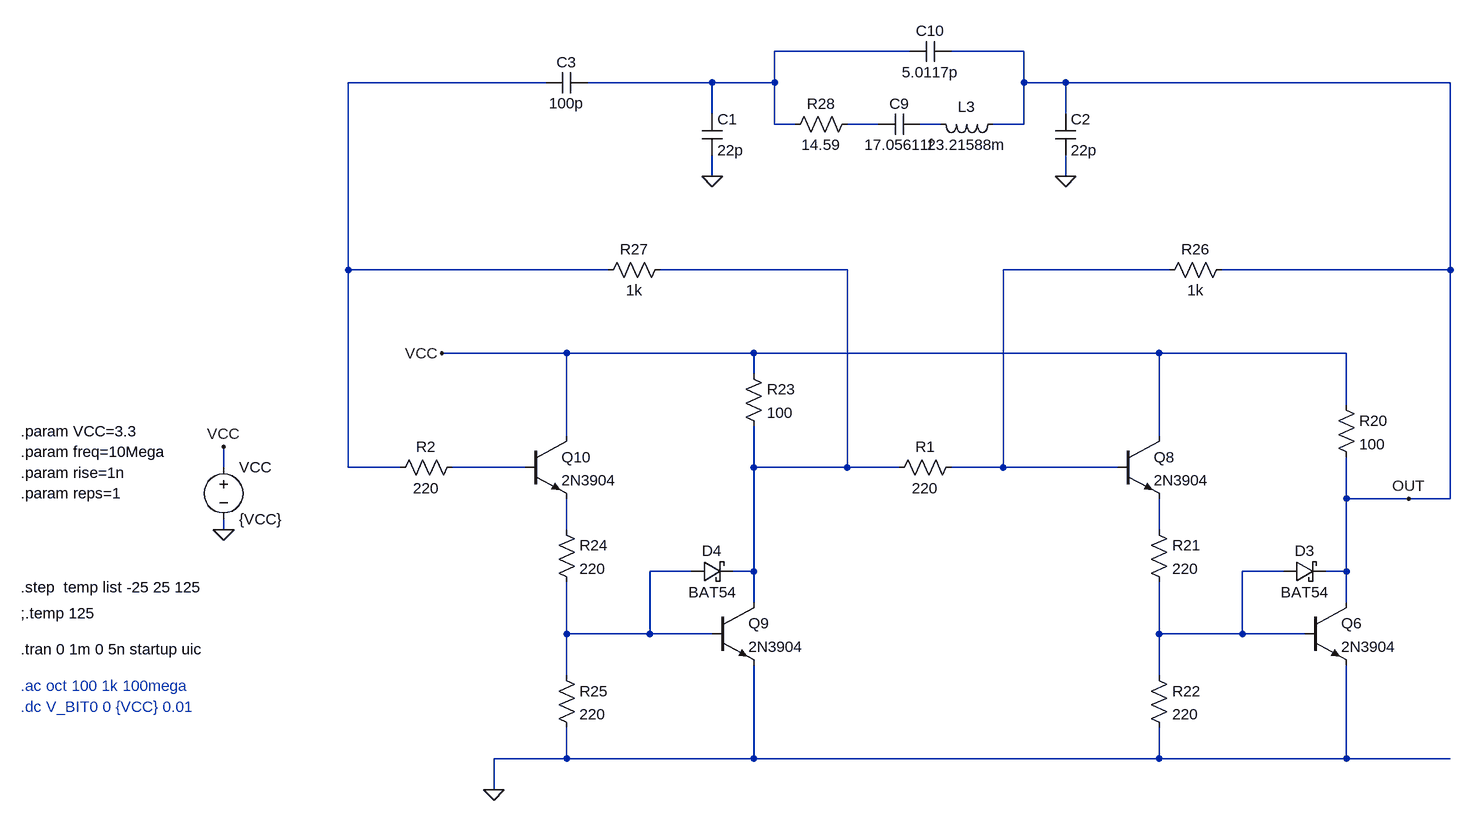
[diagram p0: schematic oscillator.asc]
oscillator.asc, the LTspice schematic file:
Version 4.1
SHEET 1 14868 11268
WIRE -3024 8272 -3232 8272
WIRE -2848 8272 -2960 8272
WIRE -3584 8320 -3888 8320
WIRE -3328 8320 -3520 8320
WIRE -3232 8320 -3232 8272
WIRE -3232 8320 -3328 8320
WIRE -2848 8320 -2848 8272
WIRE -2784 8320 -2848 8320
WIRE -2192 8320 -2784 8320
WIRE -3328 8368 -3328 8320
WIRE -2784 8368 -2784 8320
WIRE -3232 8384 -3232 8320
WIRE -3200 8384 -3232 8384
WIRE -3072 8384 -3120 8384
WIRE -2976 8384 -3008 8384
WIRE -2848 8384 -2848 8320
WIRE -2848 8384 -2896 8384
WIRE -3328 8464 -3328 8432
WIRE -2784 8464 -2784 8432
WIRE -3888 8608 -3888 8320
WIRE -3488 8608 -3888 8608
WIRE -3120 8608 -3408 8608
WIRE -2624 8608 -2880 8608
WIRE -2192 8608 -2192 8320
WIRE -2192 8608 -2544 8608
WIRE -3552 8736 -3744 8736
WIRE -3264 8736 -3552 8736
WIRE -2640 8736 -3264 8736
WIRE -2352 8736 -2640 8736
WIRE -3264 8768 -3264 8736
WIRE -2352 8816 -2352 8736
WIRE -3552 8864 -3552 8736
WIRE -2640 8864 -2640 8736
WIRE -4080 8912 -4080 8880
WIRE -3888 8912 -3888 8608
WIRE -3808 8912 -3888 8912
WIRE -3616 8912 -3728 8912
WIRE -3264 8912 -3264 8848
WIRE -3120 8912 -3120 8608
WIRE -3120 8912 -3264 8912
WIRE -3040 8912 -3120 8912
WIRE -2880 8912 -2880 8608
WIRE -2880 8912 -2960 8912
WIRE -2704 8912 -2880 8912
WIRE -2352 8960 -2352 8896
WIRE -2256 8960 -2352 8960
WIRE -2192 8960 -2192 8608
WIRE -2192 8960 -2256 8960
WIRE -4080 9008 -4080 8992
WIRE -3552 9008 -3552 8960
WIRE -2640 9008 -2640 8960
WIRE -3360 9072 -3424 9072
WIRE -3264 9072 -3264 8912
WIRE -3264 9072 -3296 9072
WIRE -2448 9072 -2512 9072
WIRE -2352 9072 -2352 8960
WIRE -2352 9072 -2384 9072
WIRE -3264 9120 -3264 9072
WIRE -2352 9120 -2352 9072
WIRE -3552 9168 -3552 9088
WIRE -3424 9168 -3424 9072
WIRE -3424 9168 -3552 9168
WIRE -3328 9168 -3424 9168
WIRE -2640 9168 -2640 9088
WIRE -2512 9168 -2512 9072
WIRE -2512 9168 -2640 9168
WIRE -2416 9168 -2512 9168
WIRE -3552 9232 -3552 9168
WIRE -2640 9232 -2640 9168
WIRE -3552 9360 -3552 9312
WIRE -3552 9360 -3664 9360
WIRE -3264 9360 -3264 9216
WIRE -3264 9360 -3552 9360
WIRE -2640 9360 -2640 9312
WIRE -2640 9360 -3264 9360
WIRE -2352 9360 -2352 9216
WIRE -2352 9360 -2640 9360
WIRE -2192 9360 -2352 9360
WIRE -3664 9408 -3664 9360
FLAG -4080 9008 0
FLAG -4080 8880 VCC
FLAG -2256 8960 OUT
FLAG -3744 8736 VCC
FLAG -3664 9408 0
FLAG -3328 8464 0
FLAG -2784 8464 0
SYMBOL voltage -4080 8896 R0
WINDOW 123 0 0 Left 0
WINDOW 39 0 0 Left 0
SYMATTR InstName VCC
SYMATTR Value {VCC}
SYMBOL npn -2416 9120 R0
SYMATTR InstName Q6
SYMATTR Value 2N3904
SYMBOL schottky -2448 9088 R270
WINDOW 0 32 32 VTop 2
WINDOW 3 0 32 VBottom 2
SYMATTR InstName D3
SYMATTR Value BAT54
SYMATTR Description Diode
SYMATTR Type diode
SYMBOL npn -2704 8864 R0
SYMATTR InstName Q8
SYMATTR Value 2N3904
SYMBOL res -2368 8800 R0
SYMATTR InstName R20
SYMATTR Value 100
SYMBOL res -2656 8992 R0
SYMATTR InstName R21
SYMATTR Value 220
SYMBOL res -2656 9216 R0
SYMATTR InstName R22
SYMATTR Value 220
SYMBOL npn -3328 9120 R0
SYMATTR InstName Q9
SYMATTR Value 2N3904
SYMBOL schottky -3360 9088 R270
WINDOW 0 32 32 VTop 2
WINDOW 3 0 32 VBottom 2
SYMATTR InstName D4
SYMATTR Value BAT54
SYMATTR Description Diode
SYMATTR Type diode
SYMBOL npn -3616 8864 R0
SYMATTR InstName Q10
SYMATTR Value 2N3904
SYMBOL res -3280 8752 R0
SYMATTR InstName R23
SYMATTR Value 100
SYMBOL res -3568 8992 R0
SYMATTR InstName R24
SYMATTR Value 220
SYMBOL res -3568 9216 R0
SYMATTR InstName R25
SYMATTR Value 220
SYMBOL res -2528 8592 R90
WINDOW 0 0 56 VBottom 2
WINDOW 3 32 56 VTop 2
SYMATTR InstName R26
SYMATTR Value 1k
SYMBOL res -3392 8592 R90
WINDOW 0 0 56 VBottom 2
WINDOW 3 32 56 VTop 2
SYMATTR InstName R27
SYMATTR Value 1k
SYMBOL ind -2880 8368 R90
WINDOW 0 5 56 VBottom 2
WINDOW 3 32 56 VTop 2
SYMATTR InstName L3
SYMATTR Value 23.21588m
SYMBOL cap -3072 8400 R270
WINDOW 0 32 32 VTop 2
WINDOW 3 0 32 VBottom 2
SYMATTR InstName C9
SYMATTR Value 17.05611f
SYMBOL cap -3024 8288 R270
WINDOW 0 32 32 VTop 2
WINDOW 3 0 32 VBottom 2
SYMATTR InstName C10
SYMATTR Value 5.0117p
SYMBOL res -3216 8400 R270
WINDOW 0 32 56 VTop 2
WINDOW 3 0 56 VBottom 2
SYMATTR InstName R28
SYMATTR Value 14.59
SYMBOL res -2944 8896 R90
WINDOW 0 0 56 VBottom 2
WINDOW 3 32 56 VTop 2
SYMATTR InstName R1
SYMATTR Value 220
SYMBOL res -3712 8896 R90
WINDOW 0 0 56 VBottom 2
WINDOW 3 32 56 VTop 2
SYMATTR InstName R2
SYMATTR Value 220
SYMBOL cap -3344 8368 R0
SYMATTR InstName C1
SYMATTR Value 22p
SYMBOL cap -2800 8368 R0
SYMATTR InstName C2
SYMATTR Value 22p
SYMBOL cap -3520 8304 R90
WINDOW 0 0 32 VBottom 2
WINDOW 3 32 32 VTop 2
SYMATTR InstName C3
SYMATTR Value 100p
TEXT -4392 9192 Left 2 !.tran 0 1m 0 5n startup uic
TEXT -4392 9248 Left 2 ;.ac oct 100 1k 100mega
TEXT -4392 9280 Left 2 ;.dc V_BIT0 0 {VCC} 0.01
TEXT -4392 8856 Left 2 !.param VCC=3.3
TEXT -4392 8888 Left 2 !.param freq=10Mega
TEXT -4392 8920 Left 2 !.param rise=1n
TEXT -4392 8952 Left 2 !.param reps=1
TEXT -4392 9096 Left 2 !.step  temp list -25 25 125
TEXT -4392 9136 Left 2 !;.temp 125

The netlist it stands for:
* oscillator.asc
VCC VCC 0 {VCC}
Q6 OUT N011 0 0 2N3904
D3 N011 OUT BAT54
Q8 VCC N006 N009 0 2N3904
R20 VCC OUT 100
R21 N009 N011 220
R22 N011 0 220
Q9 N005 N010 0 0 2N3904
D4 N010 N005 BAT54
Q10 VCC N007 N008 0 2N3904
R23 VCC N005 100
R24 N008 N010 220
R25 N010 0 220
R26 OUT N006 1k
R27 N005 N002 1k
L3 OUT N004 23.21588m
C9 N003 N004 17.05611f
C10 N001 OUT 5.0117p
R28 N001 N003 14.59
R1 N006 N005 220
R2 N007 N002 220
C1 N001 0 22p
C2 OUT 0 22p
C3 N001 N002 100p
.model D D
.lib standard.dio
.model NPN NPN
.model PNP PNP
.lib standard.bjt
.tran 0 1m 0 5n startup uic
* .ac oct 100 1k 100mega
* .dc V_BIT0 0 {VCC} 0.01
.param VCC=3.3
.param freq=10Mega
.param rise=1n
.param reps=1
.step  temp list -25 25 125
;.temp 125
.backanno
.end